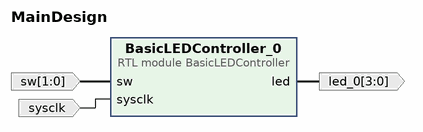
[diagram p0: block diagram of the top level]
# Vivado block design MainDesign, xc7z020clg400-1, Vivado 2024.2
create_bd_design MainDesign

create_bd_port -dir O -from 3 -to 0 led_0
create_bd_port -dir I -from 1 -to 0 sw
create_bd_port -dir I -type clk sysclk
set_property -dict {CONFIG.FREQ_HZ 125000000} [get_bd_ports sysclk]

create_bd_cell -type module -reference BasicLEDController BasicLEDController_0

# ---- connections ----

connect_bd_net [get_bd_pins BasicLEDController_0/led] [get_bd_ports led_0]
connect_bd_net [get_bd_ports sw] [get_bd_pins BasicLEDController_0/sw]
connect_bd_net [get_bd_ports sysclk] [get_bd_pins BasicLEDController_0/sysclk]

validate_bd_design
save_bd_design
